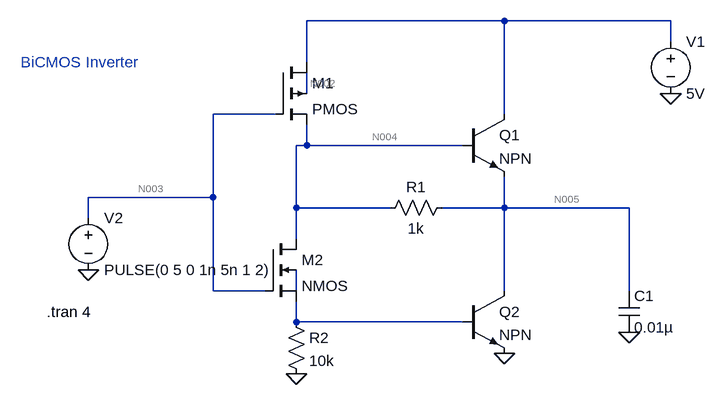
[diagram p0: schematic bicmos_inverter.asc]
bicmos_inverter.asc, the LTspice schematic file:
Version 4
SHEET 1 880 680
WIRE 432 -48 128 -48
WIRE 688 -48 432 -48
WIRE 688 -16 688 -48
WIRE 128 16 128 -48
WIRE 128 64 128 32
WIRE 80 96 -16 96
WIRE 432 96 432 -48
WIRE 128 144 128 112
WIRE 128 144 112 144
WIRE 368 144 128 144
WIRE -16 224 -16 96
WIRE -16 224 -208 224
WIRE 112 240 112 144
WIRE 256 240 112 240
WIRE 432 240 432 192
WIRE 432 240 336 240
WIRE 624 240 432 240
WIRE -208 256 -208 224
WIRE 112 288 112 240
WIRE -16 368 -16 224
WIRE 64 368 -16 368
WIRE 112 368 112 336
WIRE 432 368 432 240
WIRE 624 368 624 240
WIRE 112 416 112 384
WIRE 368 416 112 416
FLAG 432 464 0
FLAG 624 432 0
FLAG -208 336 0
FLAG 688 64 0
FLAG 112 496 0
SYMBOL npn 368 96 R0
SYMATTR InstName Q1
SYMBOL npn 368 368 R0
SYMATTR InstName Q2
SYMBOL cap 608 368 R0
SYMATTR InstName C1
SYMATTR Value 0.01µ
SYMBOL voltage 688 -32 R0
SYMATTR InstName V1
SYMATTR Value 5V
SYMBOL voltage -208 240 R0
WINDOW 123 0 0 Left 0
WINDOW 39 0 0 Left 0
SYMATTR InstName V2
SYMATTR Value PULSE(0 5 0 1n 5n 1 2)
SYMBOL res 352 224 R90
WINDOW 0 0 56 VBottom 2
WINDOW 3 32 56 VTop 2
SYMATTR InstName R1
SYMATTR Value 1k
SYMBOL res 96 400 R0
SYMATTR InstName R2
SYMATTR Value 10k
SYMBOL pmos4 80 16 R0
SYMATTR InstName M1
SYMBOL nmos4 64 288 R0
SYMATTR InstName M2
TEXT -272 400 Left 2 !.tran 4
TEXT -312 16 Left 2 ;BiCMOS Inverter

The netlist it stands for:
* bicmos_inverter.asc
Q1 N001 N004 N005 0 NPN
Q2 N005 N007 0 0 NPN
C1 N005 0 0.01µ
V1 N001 0 5V
V2 N003 0 PULSE(0 5 0 1n 5n 1 2)
R1 N005 N004 1k
R2 N007 0 10k
M1 N001 N003 N004 N002 PMOS
M2 N004 N003 N007 N006 NMOS
.model NPN NPN
.model PNP PNP
.lib standard.bjt
.model NMOS NMOS
.model PMOS PMOS
.lib standard.mos
.tran 4
* BiCMOS Inverter
.backanno
.end

* Results of the author's LTspice run, read from the files saved beside the schematic
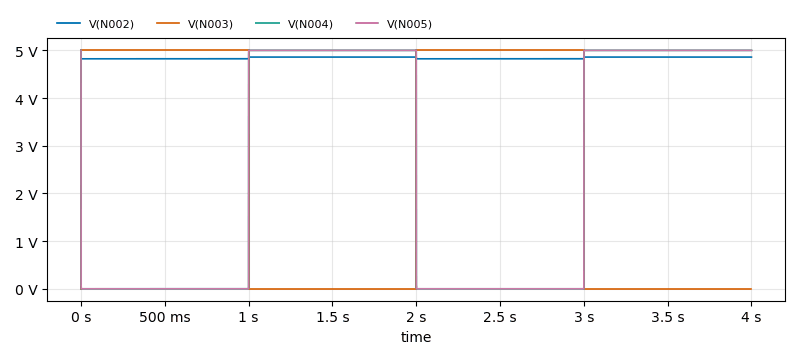
[diagram p1: Transient Analysis of bicmos_inverter.asc, plotted from the saved traces]
* Transient Analysis, 1 run:
*   V(N002): min 4.823 V, max 4.859 V, average 4.841 V, rms 4.841 V, last 4.859 V
*   V(N003): min 0 V, max 5 V, average 2.5 V, rms 3.536 V, last 0 V
*   V(N004): min -7.228 µV, max 5 V, average 2.5 V, rms 3.535 V, last 5 V
*   V(N005): min -7.604 µV, max 5 V, average 2.5 V, rms 3.535 V, last 5 V